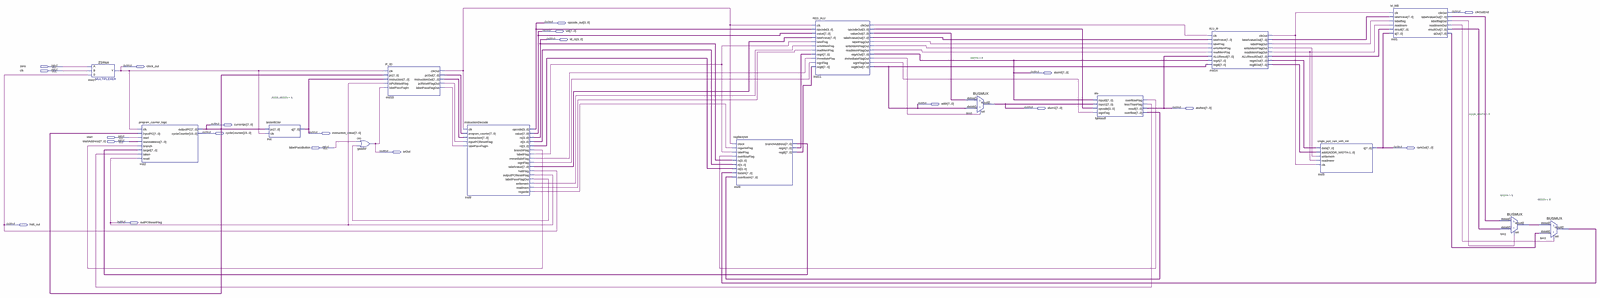
[diagram p0: schematic sheet, whole]
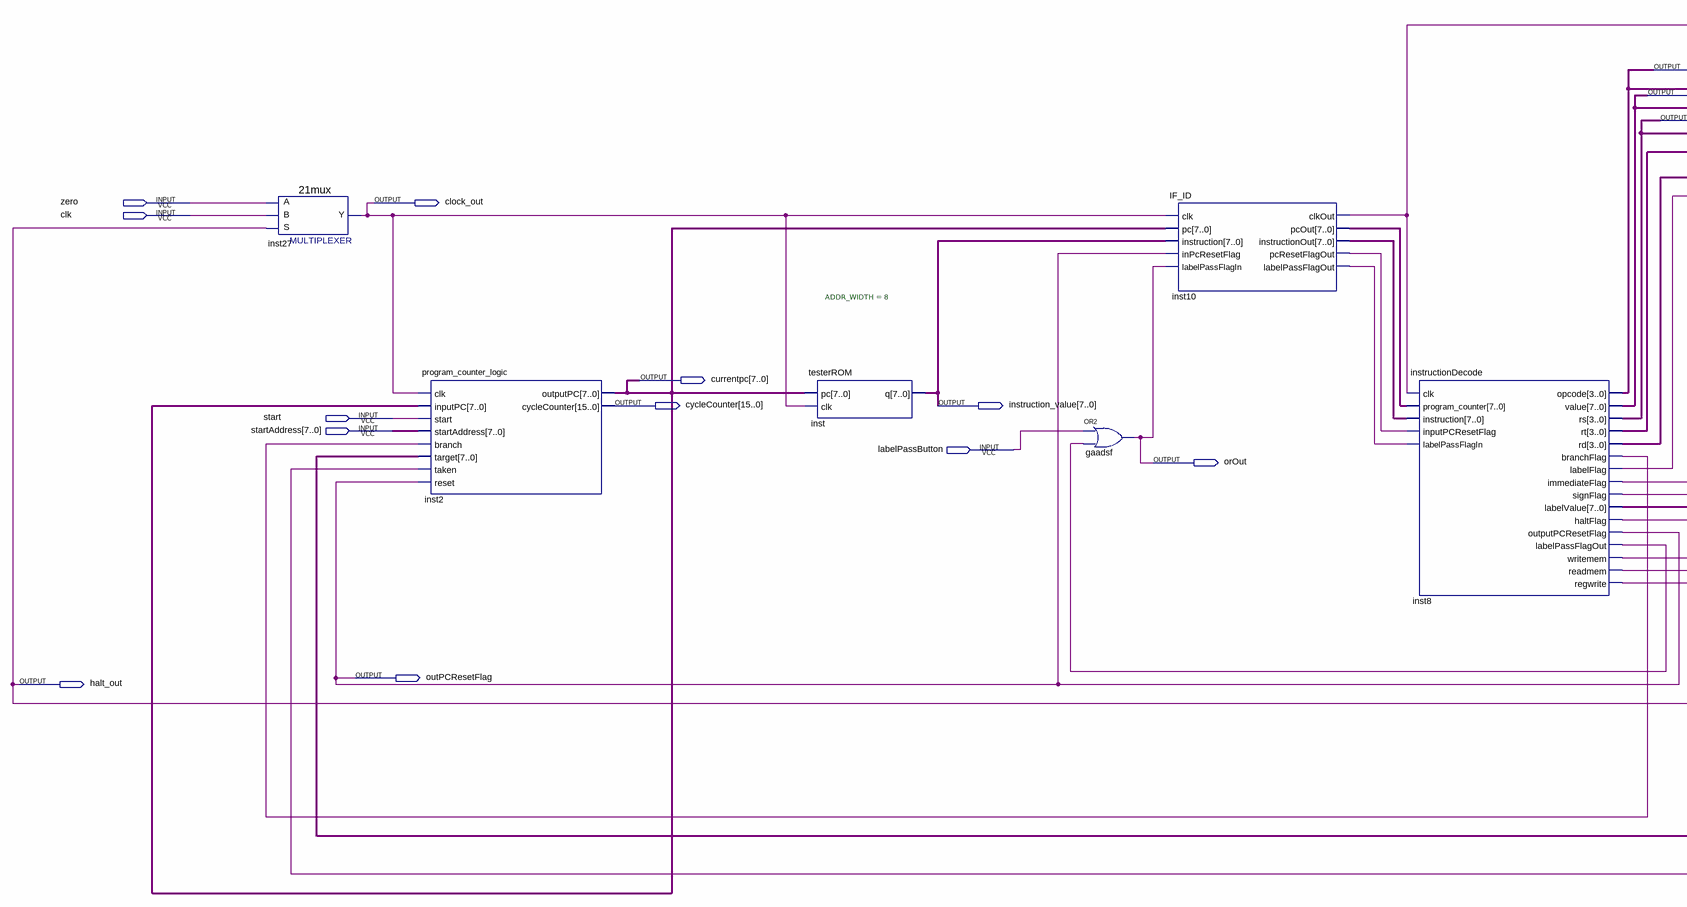
[diagram p1: schematic sheet, left part]
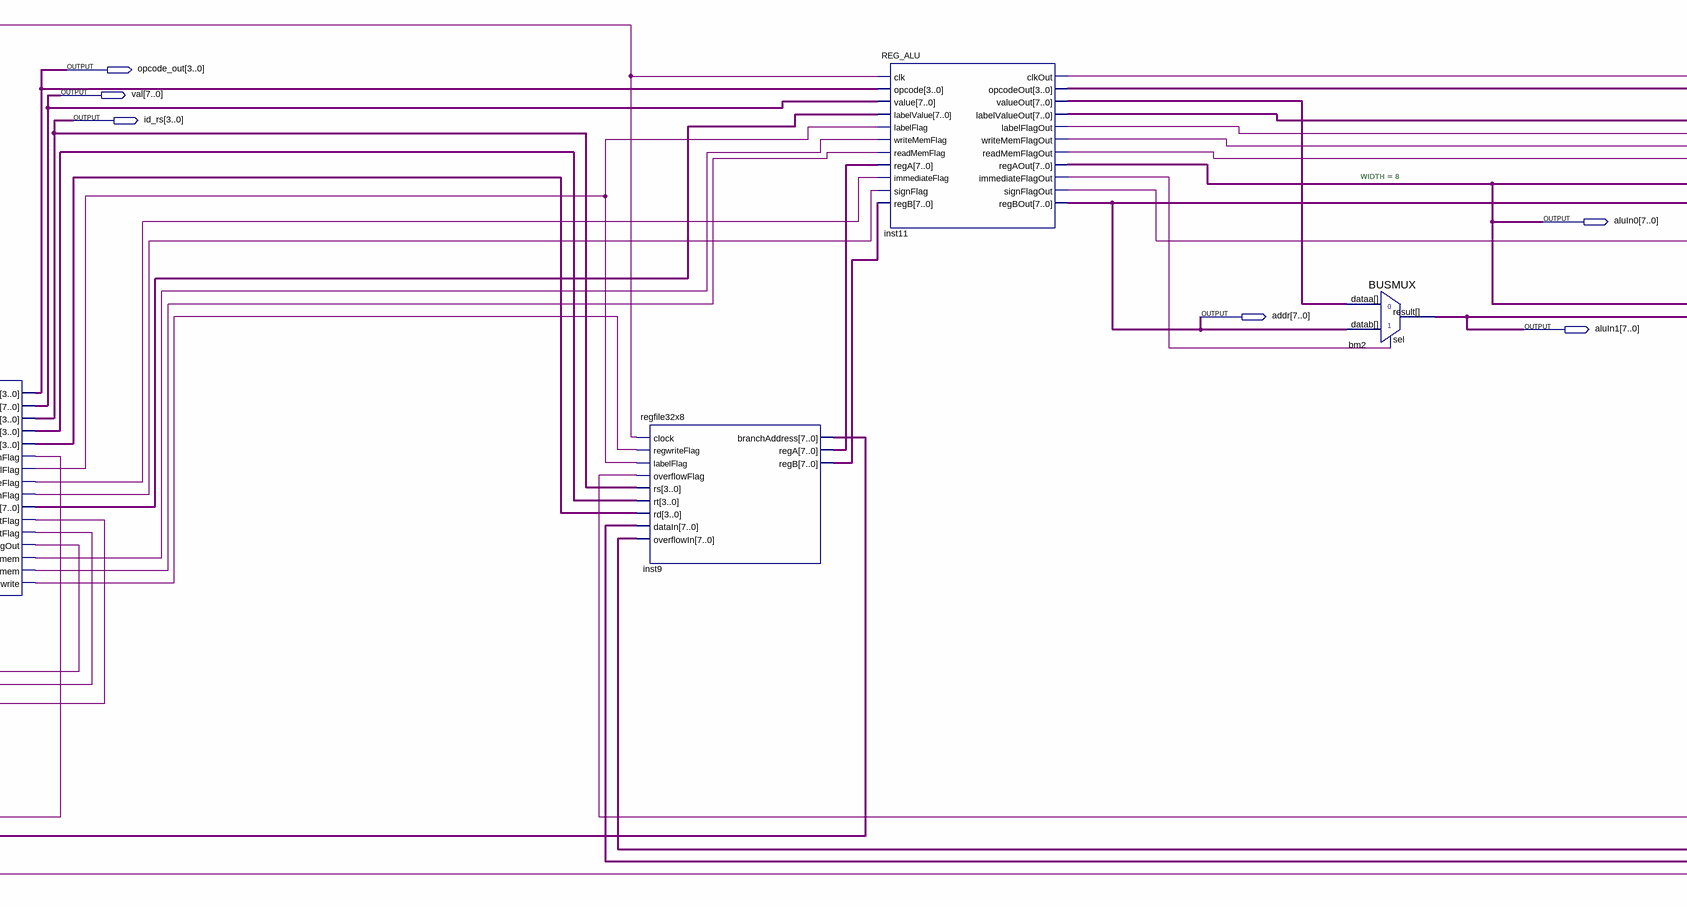
[diagram p2: schematic sheet, centre part]
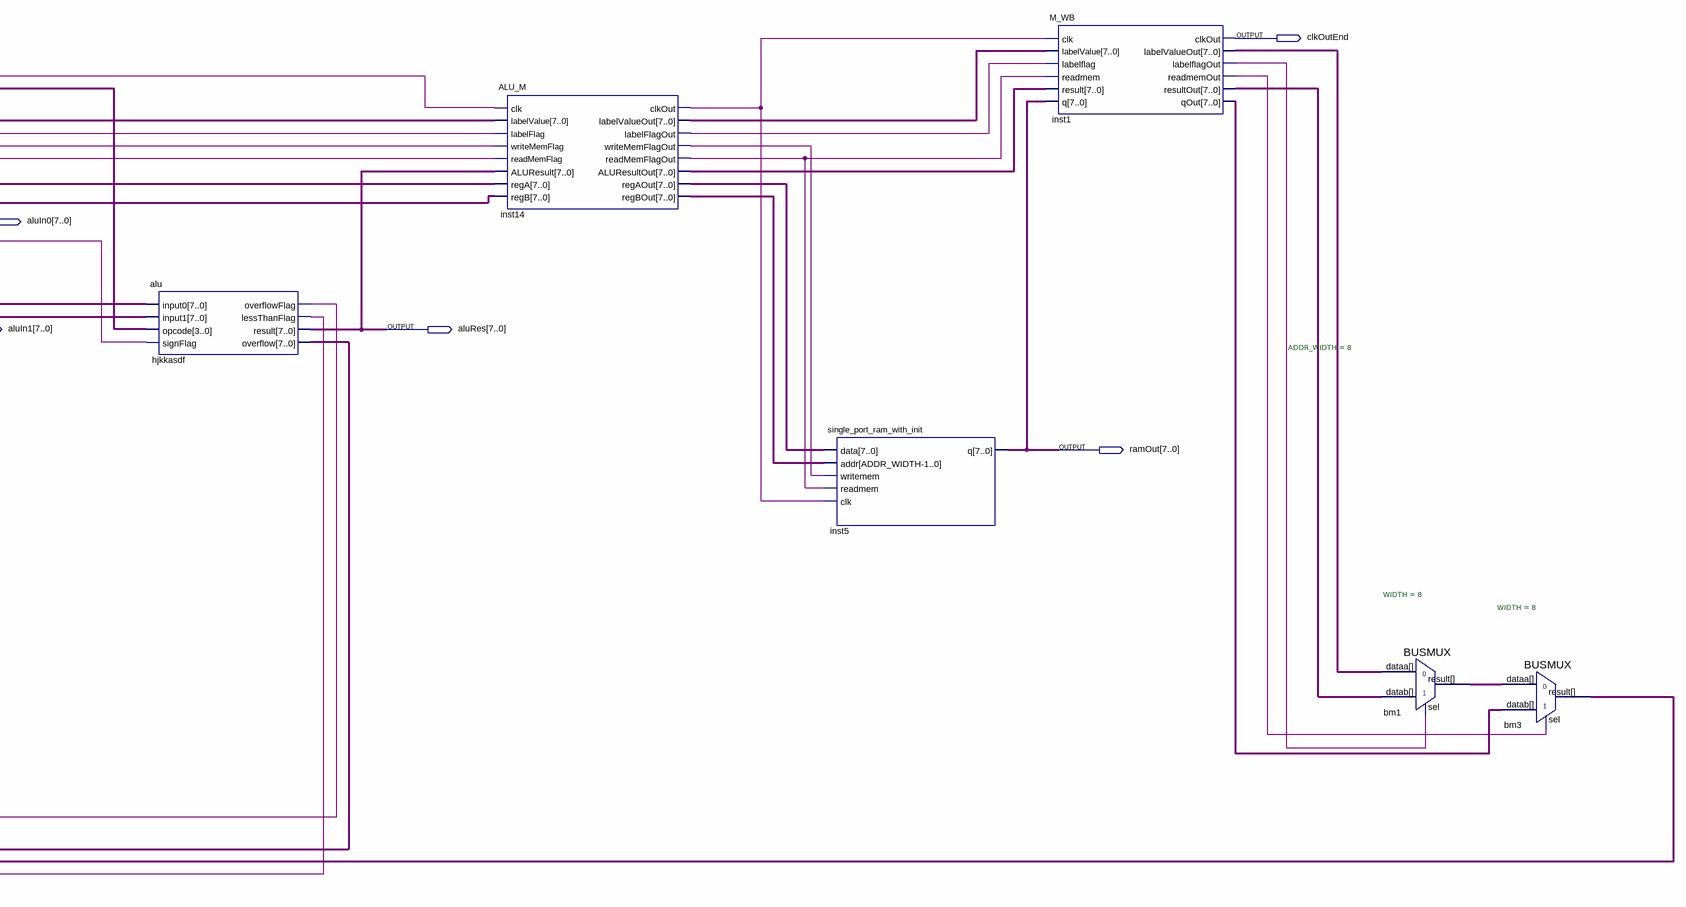
[diagram p3: schematic sheet, right part]
// Quartus schematic CS141L.bdf as structural Verilog: 15 symbols, 21 pins
module CS141L (
  input  zero,
  input  clk,
  input  start,
  input  [7:0] startAddress,
  input  labelPassButton,
  output clkOutEnd,
  output [3:0] opcode_out,
  output [7:0] val,
  output [3:0] id_rs,
  output clock_out,
  output [7:0] aluIn0,
  output [7:0] addr,
  output [7:0] aluIn1,
  output [7:0] aluRes,
  output [7:0] currentpc,
  output [15:0] cycleCounter,
  output [7:0] instruction_value,
  output [7:0] ramOut,
  output orOut,
  output outPCResetFlag,
  output halt_out
);

  wire hjkkasdf_lessthanflag, hjkkasdf_overflowflag, inst1_labelflagout, inst1_readmemout, inst8_branchflag,
       inst8_immediateflag, inst8_labelflag, inst8_labelpassflagout, inst8_readmem, inst8_regwrite,
       inst8_signflag, inst8_writemem, inst10_clkout, inst10_labelpassflagout, inst10_pcresetflagout,
       inst11_clkout, inst11_immediateflagout, inst11_labelflagout, inst11_readmemflagout,
       inst11_signflagout, inst11_writememflagout, inst14_clkout, inst14_labelflagout, inst14_readmemflagout,
       inst14_writememflagout;
  wire [3:0] inst8_rd, inst8_rt, inst11_opcodeout;
  wire [7:0] bm1_result, bm3_result, hjkkasdf_overflow, inst1_labelvalueout, inst1_qout, inst1_resultout,
       inst8_labelvalue, inst9_branchaddress, inst9_rega, inst9_regb, inst10_instructionout, inst10_pcout,
       inst11_labelvalueout, inst11_valueout, inst14_aluresultout, inst14_labelvalueout, inst14_regaout,
       inst14_regbout;

  \21mux  inst27 (.S(halt_out), .B(clk), .A(zero), .Y(clock_out));
  program_counter_logic inst2 (
    .clk(clock_out), .inputPC(currentpc), .start(start), .startAddress(startAddress),
    .branch(inst8_branchflag), .target(inst9_branchaddress), .taken(hjkkasdf_lessthanflag),
    .reset(outPCResetFlag), .outputPC(currentpc), .cycleCounter(cycleCounter));
  testerROM #(.ADDR_WIDTH(8)) inst (.pc(currentpc), .clk(clock_out), .q(instruction_value));
  or gaadsf (orOut, labelPassButton, inst8_labelpassflagout);
  IF_ID inst10 (
    .clk(clock_out), .pc(currentpc), .instruction(instruction_value), .inPcResetFlag(outPCResetFlag),
    .labelPassFlagIn(orOut), .clkOut(inst10_clkout), .pcOut(inst10_pcout),
    .instructionOut(inst10_instructionout), .pcResetFlagOut(inst10_pcresetflagout),
    .labelPassFlagOut(inst10_labelpassflagout));
  instructionDecode inst8 (
    .clk(inst10_clkout), .program_counter(inst10_pcout), .instruction(inst10_instructionout),
    .inputPCResetFlag(inst10_pcresetflagout), .labelPassFlagIn(inst10_labelpassflagout), .opcode(opcode_out),
    .value(val), .rs(id_rs), .rt(inst8_rt), .rd(inst8_rd), .branchFlag(inst8_branchflag),
    .labelFlag(inst8_labelflag), .immediateFlag(inst8_immediateflag), .signFlag(inst8_signflag),
    .labelValue(inst8_labelvalue), .haltFlag(halt_out), .outputPCResetFlag(outPCResetFlag),
    .labelPassFlagOut(inst8_labelpassflagout), .writemem(inst8_writemem), .readmem(inst8_readmem),
    .regwrite(inst8_regwrite));
  regfile32x8 inst9 (
    .clock(inst10_clkout), .regwriteFlag(inst8_regwrite), .labelFlag(inst8_labelflag),
    .overflowFlag(hjkkasdf_overflowflag), .rs(id_rs), .rt(inst8_rt), .rd(inst8_rd), .dataIn(bm3_result),
    .overflowIn(hjkkasdf_overflow), .branchAddress(inst9_branchaddress), .regA(inst9_rega), .regB(inst9_regb));
  REG_ALU inst11 (
    .clk(inst10_clkout), .opcode(opcode_out), .value(val), .labelValue(inst8_labelvalue),
    .labelFlag(inst8_labelflag), .writeMemFlag(inst8_writemem), .readMemFlag(inst8_readmem),
    .regA(inst9_rega), .immediateFlag(inst8_immediateflag), .signFlag(inst8_signflag), .regB(inst9_regb),
    .clkOut(inst11_clkout), .opcodeOut(inst11_opcodeout), .valueOut(inst11_valueout),
    .labelValueOut(inst11_labelvalueout), .labelFlagOut(inst11_labelflagout),
    .writeMemFlagOut(inst11_writememflagout), .readMemFlagOut(inst11_readmemflagout), .regAOut(aluIn0),
    .immediateFlagOut(inst11_immediateflagout), .signFlagOut(inst11_signflagout), .regBOut(addr));
  BUSMUX #(.WIDTH(8)) bm2 (.datab(addr), .sel(inst11_immediateflagout), .dataa(inst11_valueout), .result(aluIn1));
  alu hjkkasdf (
    .input0(aluIn0), .input1(aluIn1), .opcode(inst11_opcodeout), .signFlag(inst11_signflagout),
    .overflowFlag(hjkkasdf_overflowflag), .lessThanFlag(hjkkasdf_lessthanflag), .result(aluRes),
    .overflow(hjkkasdf_overflow));
  ALU_M inst14 (
    .clk(inst11_clkout), .labelValue(inst11_labelvalueout), .labelFlag(inst11_labelflagout),
    .writeMemFlag(inst11_writememflagout), .readMemFlag(inst11_readmemflagout), .ALUResult(aluRes),
    .regA(aluIn0), .regB(addr), .clkOut(inst14_clkout), .labelValueOut(inst14_labelvalueout),
    .labelFlagOut(inst14_labelflagout), .writeMemFlagOut(inst14_writememflagout),
    .readMemFlagOut(inst14_readmemflagout), .ALUResultOut(inst14_aluresultout), .regAOut(inst14_regaout),
    .regBOut(inst14_regbout));
  single_port_ram_with_init #(.ADDR_WIDTH(8)) inst5 (
    .data(inst14_regaout), .addr(inst14_regbout), .writemem(inst14_writememflagout),
    .readmem(inst14_readmemflagout), .clk(inst14_clkout), .q(ramOut));
  M_WB inst1 (
    .clk(inst14_clkout), .labelValue(inst14_labelvalueout), .labelflag(inst14_labelflagout),
    .readmem(inst14_readmemflagout), .result(inst14_aluresultout), .q(ramOut), .clkOut(clkOutEnd),
    .labelValueOut(inst1_labelvalueout), .labelflagOut(inst1_labelflagout), .readmemOut(inst1_readmemout),
    .resultOut(inst1_resultout), .qOut(inst1_qout));
  BUSMUX #(.WIDTH(8)) bm1 (
    .datab(inst1_resultout), .sel(inst1_labelflagout), .dataa(inst1_labelvalueout), .result(bm1_result));
  BUSMUX #(.WIDTH(8)) bm3 (.datab(inst1_qout), .sel(inst1_readmemout), .dataa(bm1_result), .result(bm3_result));
endmodule
